# EAGLE design cc2530-LR-standalone-router (EAGLE 9.6.2)
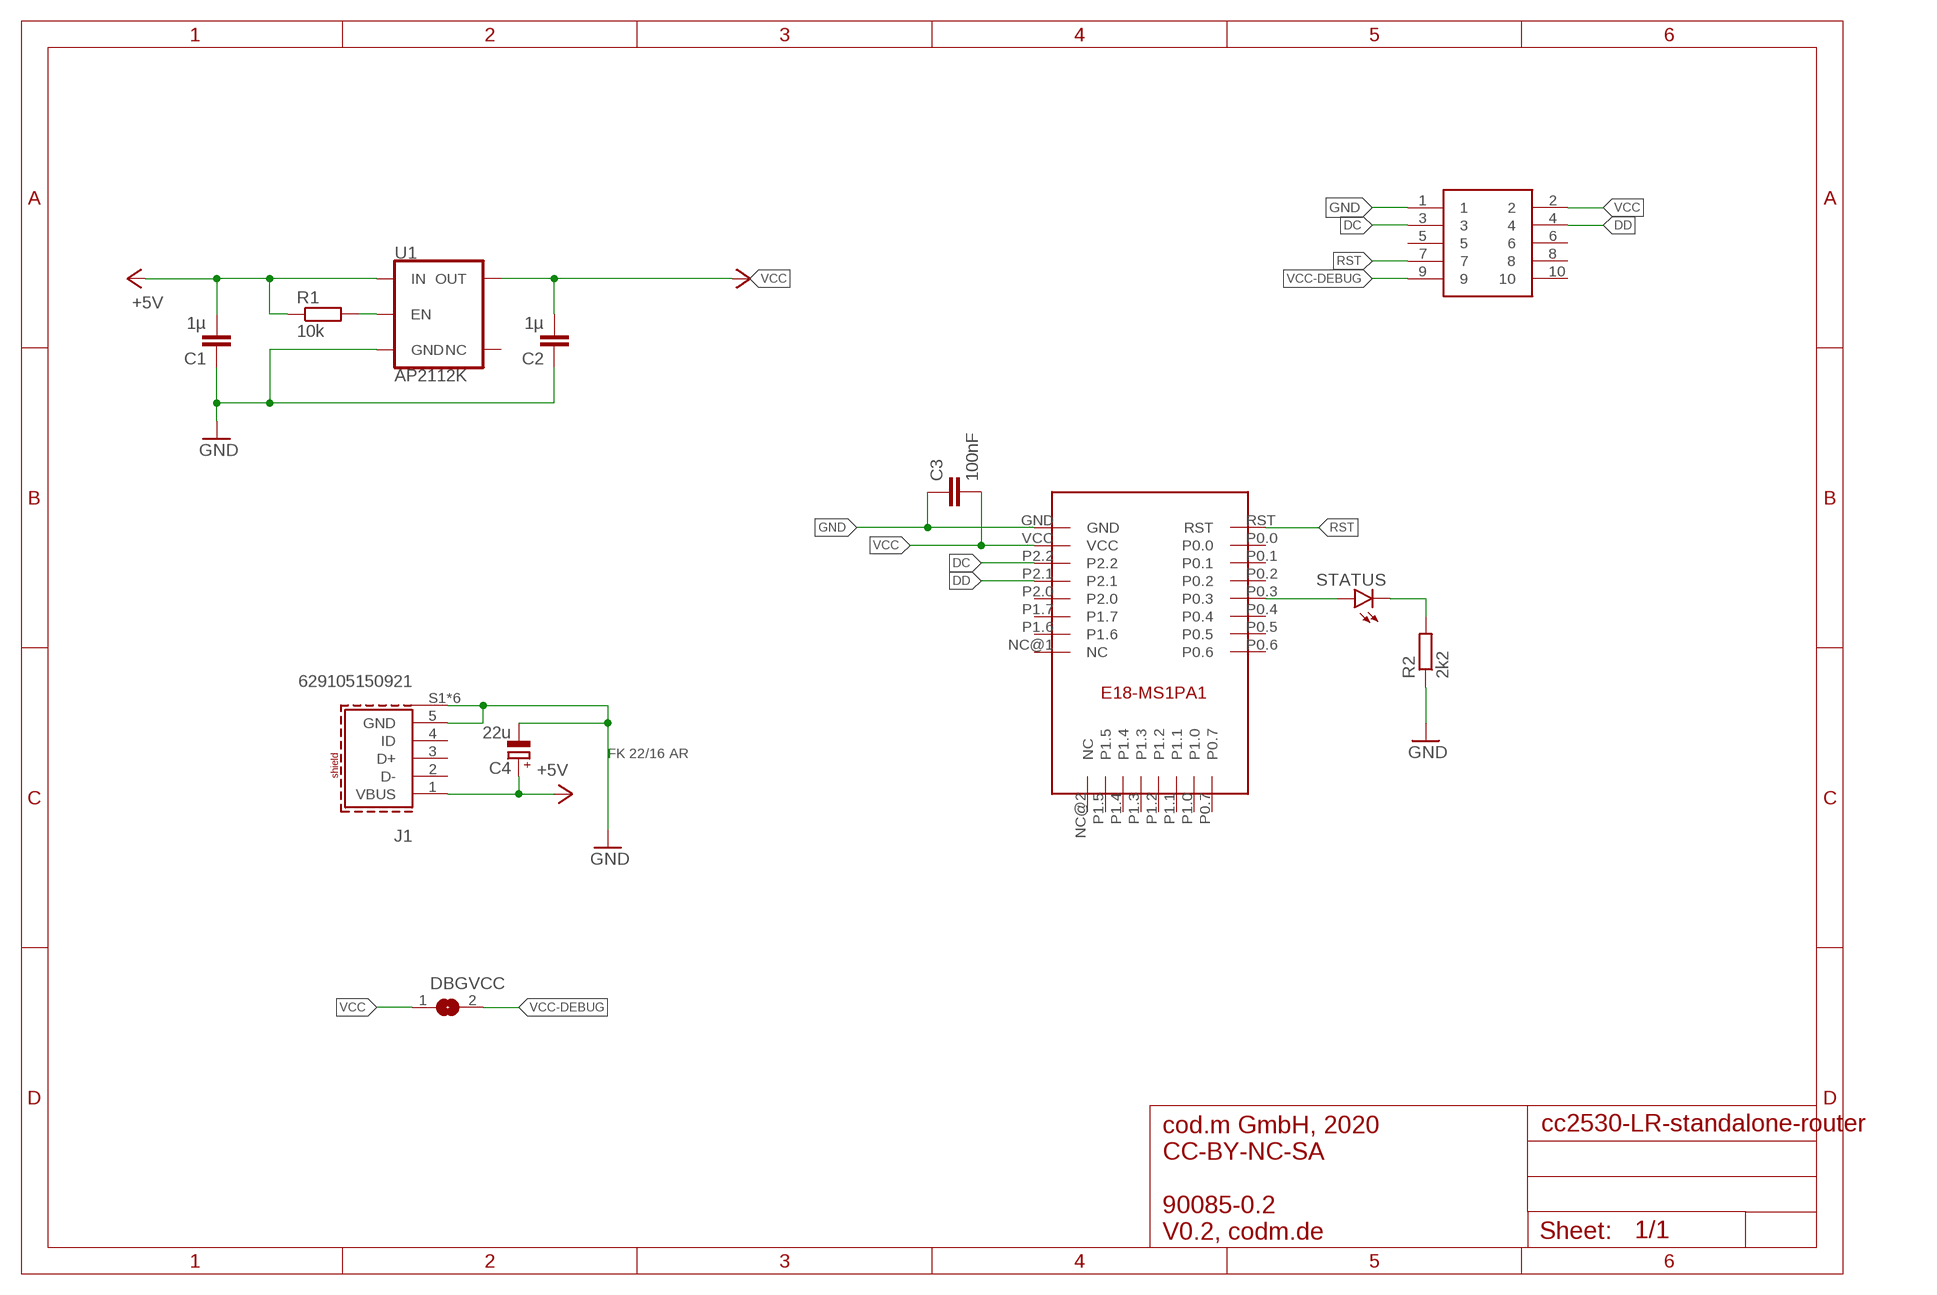
[diagram p0: schematic, sheet 1]

## Parts
C1  1µ  C-EUC0805  [C0805]
C2  1µ  C-EUC0805  [C0805]
C3  100nF  C-EUC0805  [C0805]
C4  22u  CPOL-EUC  [PANASONIC_C]
DBGVCC  SJ  [SJ]
DEBUG  20021121-00010C4LF  [2002112100010C4LF]
J1  629105150921  [629105150921]
R1  10k  R-EU_R0805  [R0805]
R2  2k2  R-EU_R0805  [R0805]
STATUS  LEDCHIPLED_0805  [CHIPLED_0805]
U1  AP2112K  V_REG_AP2112K-3.3V  [SOT23-5]
U$5  E18-MS1PA1IPX  [E18-MS1PA1-IPX]

## Nets
+5V: C1.2 C4.+ J1.1(VBUS) R1.1 U1.1(IN)
DC: DEBUG.3 U$5.P2.2
DD: DEBUG.4 U$5.P2.1
GND: C1.1 C2.1 C3.1 C4.- DEBUG.1 J1.5(GND) J1.S1(SHIELD) J1.S2(SHIELD) J1.S3(SHIELD) J1.S4(SHIELD) J1.S5(SHIELD) J1.S6(SHIELD) R2.1 U1.2(GND) U$5.GND
N$1: R1.2 U1.3(EN)
N$2: R2.2 STATUS.C
N$3: STATUS.A U$5.P0.3
RST: DEBUG.7 U$5.RST
VCC: C2.2 C3.2 DBGVCC.1 DEBUG.2 U1.5(OUT) U$5.VCC ; supply symbol labelled +3V3
VCC-DEBUG: DBGVCC.2 DEBUG.9
Unconnected: DEBUG.5 DEBUG.6 DEBUG.8 DEBUG.10 J1.2(D-) J1.3(D+) J1.4(ID) U1.4(NC) U$5.NC@1(NC) U$5.NC@2(NC) U$5.P0.0 U$5.P0.1 U$5.P0.2 U$5.P0.4 U$5.P0.5 U$5.P0.6 U$5.P0.7 U$5.P1.0 U$5.P1.1 U$5.P1.2 U$5.P1.3 U$5.P1.4 U$5.P1.5 U$5.P1.6 U$5.P1.7 U$5.P2.0

## Notes on the sheet
- FK 22/16 AR
- cod.m GmbH, 2020
  CC-BY-NC-SA
  
  90085-0.2
  V0.2, codm.de

## Library data of the parts
C1-C3 = rcl:C-EU: CAPACITOR, European symbol; SPICEPREFIX: C
C4 = rcl:CPOL-EU: POLARIZED CAPACITOR, European symbol; SPICEPREFIX: C
DBGVCC = jumper:SJ: SMD solder JUMPER
DEBUG = 20021121-00010C4LF:20021121-00010C4LF: Headers & Wire Housings 1.27x1.27mm BTB, Hdr Unshrd, SMT, 10 Pos Source: Datasheet; DESCRIPTION: Headers & Wire Housings 1.27x1.27mm BTB, Hdr Unshrd, SMT, 10 Pos; HEIGHT: 4.55mm; MANUFACTURER_NAME: Amphenol; MANUFACTURER_PART_NUMBER: 20021121-00010C4LF; MOUSER_PART_NUMBER: 649-202112100010C4LF; MOUSER_PRICE-STOCK: https://www.mouser.com/Search/Refine.aspx?Keyword=649-202112100010C4LF
J1 = WR-USB_Rev20b:629105150921: WR-COM Micro USB 2.0 Type AB Horizontal Kind Properties Durability:10 000 Mating cycles Connector Type:Micro USB Gender:Receptacle Type:Horizontal General Information Operating Temperature:-40up to +85 °C Electrical Properties Working Voltage:30V (AC) Withstanding Voltage:100V (AC) Contact Resistance:30 mΩ Material Properties Insulator Material:LCP Insulator Flammability Rating:UL94 V-0 Color:Black Contact Material:Copper Alloy Contact Plating: Gold Contact Type:Stamped Shielding Material:Stainless Steel Shielding Plating:Matte Tin <https://www.we-online.com/catalog/media/o33046v209%20Family_WR-COM_Micro_USB_629105150921.jpg> Details see: https://www.we-online.com/catalog/en/COM_MICRO_2_0_TYPE_AB_HORIZONTAL/ Updated by Ella Wu 2020-05-27 2020 (C) Würth Elektronik; APPLICATION: Micro USB 2.0; DATASHEET-URL: https://www.we-online.com/catalog/datasheet/629105150921.pdf; GERDER: Receptacle; INTERFACE-TYPE: Type AB; IR1: 1.8A; MOUNT: SMT; PACKAGING: Tape and Reel; PART-NUMBER: 629105150921; PINS: 5; TYPE: Horizontal; WORKING-VOLTAGE: 30V(AC)
R1 R2 = rcl:R-EU_: RESISTOR, European symbol; SPICEPREFIX: R
STATUS = led:LED: LED OSRAM: - CHIPLED LG R971, LG N971, LY N971, LG Q971, LY Q971, LO R971, LY R971 LH N974, LH R974 LS Q976, LO Q976, LY Q976 LO Q996 - Hyper CHIPLED LW Q18S LB Q993, LB Q99A, LB R99A - SideLED LS A670, LO A670, LY A670, LG A670, LP A670 LB A673, LV A673, LT A673, LW A673 LH A674 LY A675 LS A676, LA A676, LO A676, LY A676, LW A676 LS A679, LY A679, LG A679 - Hyper Micro SIDELED® LS Y876, LA Y876, LO Y876, LY Y876 LT Y87S - SmartLED LW L88C, LW L88S LB L89C, LB L89S, LG L890 LS L89K, LO L89K, LY L89K LS L896, LA L896, LO L896, LY L896 - TOPLED LS T670, LO T670, LY T670, LG T670, LP T670 LSG T670, LSP T670, LSY T670, LOP T670, LYG T670 LG T671, LOG T671, LSG T671 LB T673, LV T673, LT T673, LW T673 LH T674 LS T676, LA T676, LO T676, LY T676, LB T676, LH T676, LSB T676, LW T676 LB T67C, LV T67C, LT T67C, LS T67K, LO T67K, LY T67K, LW E67C LS E67B, LA E67B, LO E67B, LY E67B, LB E67C, LV E67C, LT E67C LW T67C LS T679, LY T679, LG T679 LS T770, LO T770, LY T770, LG T770, LP T770 LB T773, LV T773, LT T773, LW T773 LH T774 LS E675, LA E675, LY E675, LS T675 LS T776, LA T776, LO T776, LY T776, LB T776 LHGB T686 LT T68C, LB T68C - Hyper Mini TOPLED® LB M676 - Mini TOPLED Santana® LG M470 LS M47K, LO M47K, LY M47K Source: http://www.osram.convergy.de LUXEON: - LUMILED® LXK2-PW12-R00, LXK2-PW12-S00, LXK2-PW14-U00, LXK2-PW14-V00 LXK2-PM12-R00, LXK2-PM12-S00, LXK2-PM14-U00 LXK2-PE12-Q00, LXK2-PE12-R00, LXK2-PE12-S00, LXK2-PE14-T00, LXK2-PE14-U00 LXK2-PB12-K00, LXK2-PB12-L00, LXK2-PB12-M00, LXK2-PB14-N00, LXK2-PB14-P00, LXK2-PB14-Q00 LXK2-PR12-L00, LXK2-PR12-M00, LXK2-PR14-Q00, LXK2-PR14-R00 LXK2-PD12-Q00, LXK2-PD12-R00, LXK2-PD12-S00 LXK2-PH12-R00, LXK2-PH12-S00 LXK2-PL12-P00, LXK2-PL12-Q00, LXK2-PL12-R00 Source: www.luxeon.com KINGBRIGHT: KA-3528ASYC Source: www.kingbright.com
U1 = SparkFun-IC-Power:V_REG_AP2112: AP2112 - 600mA CMOS LDO Regulator w/ Enable The AP2112 is CMOS process low dropout linear regulator with enable function, the regulator delivers a guaranteed 600mA (min.) continuous load current. Features Output Voltage Accuracy: ±1.5% Output Current: 600mA (Min.) Foldback Short Current Protection: 50mA Enable Function to Turn ON/OFF VOUT Low Dropout Voltage (3.3V): 250mV (Typ.) @IOUT=600mA Excellent Load Regulation: 0.2%/A (Typ.) Excellent Line Regulation: 0.02%/V (Typ.) Low Quiescent Current: 55μA (Typ.) Low Standby Current: 0.01μA (Typ.) Low Output Noise: 50μVRMS PSRR: 100Hz -65dB, 1kHz -65dB OTSD Protection Stable with 1.0μF Flexible Cap: Ceramic, Tantalum and Aluminum Electrolytic Operation Temperature Range: -40°C to 85°C ESD: MM 400V, HBM 4000V; PROD_ID: VREG-12457; VALUE: 3.3V
U$5 = codm:E18-MS1PA1

## Board
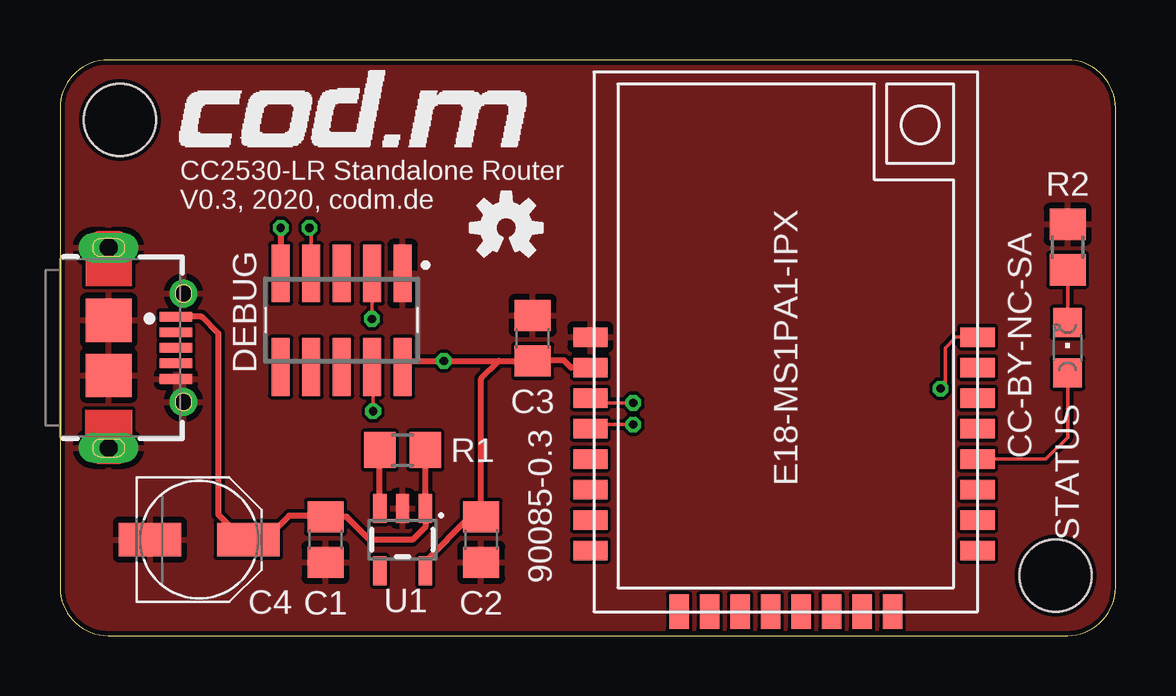
[diagram p1: board, top side]
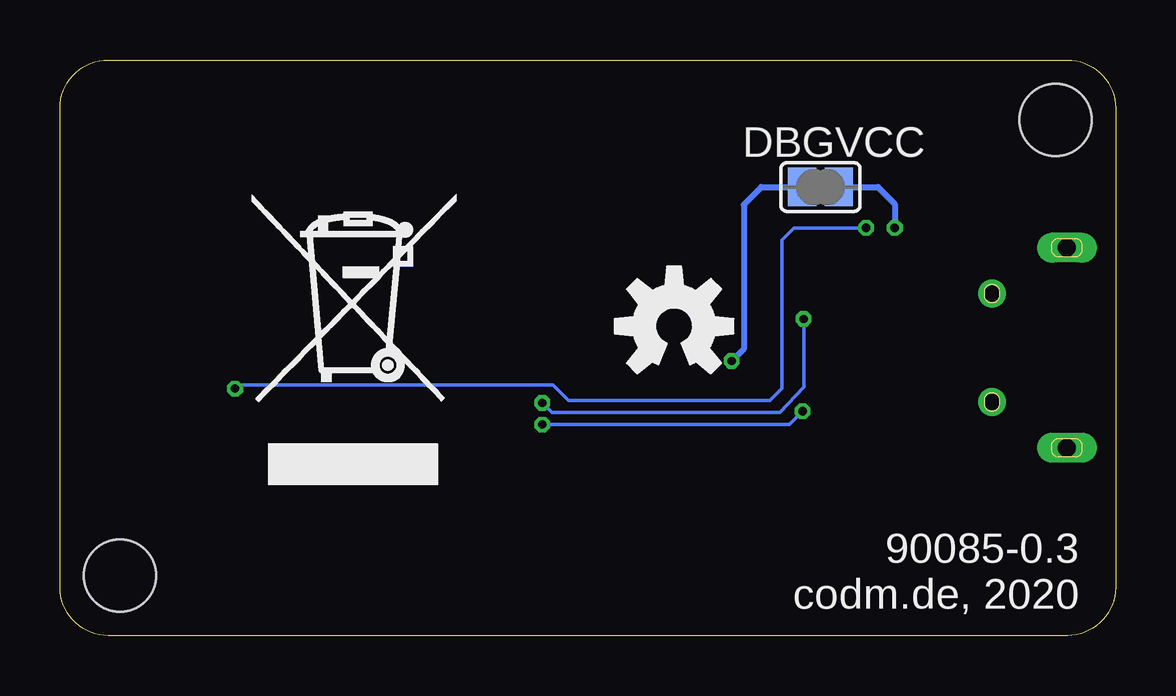
[diagram p2: board, bottom side, seen from below]

Size 44 x 24 mm. Coordinates in mm from the lower left corner, seen from the top.
Outline: 0,2 arc90 2,0 42,0 arc90 44,2 44,22 arc90 42,24 2,24 arc90 0,22 0,2
Copper layers (1*16): Top 0.035mm / dielectric 1.5mm / Bottom 0.035mm
Design rules "aisler_2_layer": minimum track width 0.1mm, minimum drill 0.2mm, track to track 0.15mm, track to pad 0.1mm, pad to pad 0.1mm, via to via 0.1mm, smd to smd 0.1mm, copper to edge 0.2mm, drill to drill 0.21mm, minimum pad ring 0.25mm, minimum via ring 0.15mm, stop-mask expansion 0mil, vias tented up to drill 0mil, thermal gap 10mil
Holes 3 mm at 41.5,2.5 2.5,21.5

### Footprints (pad centres in the part's own frame; a part is rotated, then mirrored left to right if it is on the bottom)
C0805 = smd 1.3 x 1.5: 1 -0.95,0; 2 0.95,0
PANASONIC_C = smd 2.6 x 1.4: + 2.05,0; - -2.05,0
SJ = smd 1.168 x 1.6: 1 -0.762,0; 2 0.762,0
2002112100010C4LF = smd 0.76 x 2.4: 1 -2.54,-1.95; 2 -2.54,1.95; 3 -1.27,-1.95; 4 -1.27,1.95; 5 0,-1.95; 6 0,1.95; 7 1.27,-1.95; 8 1.27,1.95; 9 2.54,-1.95; 10 2.54,1.95
629105150921 = smd 0.4 x 1.35: 1 -1.3,2.335; 2 -0.65,2.335; 3 0,2.335; 4 0.65,2.335; 5 1.3,2.335 | drill 0.65 pad 1.05: S1 -2.26,2.65; S2 2.26,2.65 | drill 0.75 pad 0.95 long: S3 -4.175,-0.47; S6 4.175,-0.47 | smd 1.8 x 1.9: S4 -1.15,-0.47; S5 1.15,-0.47
R0805 = smd 1.3 x 1.5: 1 -0.95,0; 2 0.95,0
CHIPLED_0805 = smd 1.2 x 1.2: A 0,-1.05; C 0,1.05
SOT23-5 = smd 0.55 x 1.2: 1 -0.95,-1.3; 2 0,-1.3; 3 0.95,-1.3; 4 0.95,1.3; 5 -0.95,1.3
E18-MS1PA1-IPX = smd 0.813 x 1.422: GND 11.44,16.14; NC@1 2.55,16.14; P0.0 10.17,0; P0.1 8.9,0; P0.2 7.63,0; P0.3 6.36,0; P0.4 5.09,0; P0.5 3.82,0; P0.6 2.55,0; P1.6 3.82,16.14; P1.7 5.09,16.14; P2.0 6.36,16.14; P2.1 7.63,16.14; P2.2 8.9,16.14; RST 11.44,0; VCC 10.17,16.14 | smd 1.422 x 0.813: NC@2 0,12.44; P0.7 0,3.55; P1.0 0,4.82; P1.1 0,6.09; P1.2 0,7.36; P1.3 0,8.63; P1.4 0,9.9; P1.5 0,11.17

### Placement (x,y rotation side)
C1  11.07,4 90 top
C2  17.56,4 90 top
C3  19.7,12.4 270 top
C4  5.8,4 0 top
DBGVCC  12.3,18.7 0 bottom
DEBUG  11.74,13.15 180 top
J1  2.5,12 270 top
R1  14.28,7.73 180 top
R2  42,16.2 270 top
STATUS  42,12 0 top
U1  14.28,4 180 top
U$1  [WEEE-LOGO-8MM]  36,6.3 0 bottom
U$2  [CODM-LOGO]  5,20.4 0 top
U$3  [OSHW-LOGO-M]  18.4,12.9 0 bottom
U$4  [OSHW-LOGO-S]  18.6,17 0 top
U$5  38.25,1 90 top

### Tracks (layer width: path | path; a pad name or v marks a point on that pad's centre or on a via)
+5V
  Top 0.152: C4.+ 8.55,4
  Top 0.254: R1.1 U1.1 15.23,4.53 14.7,4 12.9,4 11.95,4.95 C1.2 11.02,5 9.55,5 8.55,4 | J1.1 5.9,13.3 6.6,12.6 6.6,5.05 7.65,4 C4.+
DC  (via drill 0.35)
  Top 0.152: DEBUG.3 v13.01,13.21 v13,13.2 | U$5.P2.2 22.45,9.7 v23.9,9.7
  Bottom 0.152: v13,13.2 13,10.38 14,9.3 23.5,9.3 v23.9,9.7
DD  (via drill 0.35)
  Top 0.152: DEBUG.4 13.05,11.16 v13.05,9.35 | U$5.P2.1 22.37,8.77 22.4,8.8 v23.9,8.8
  Bottom 0.152: v23.9,8.8 13.6,8.8 v13.05,9.35
GND
  pour Top: 0,0 0,24 44,24 44,0
N$1
  Top 0.254: U1.3 R1.2
N$2
  Top 0.152: R2.2 STATUS.C
N$3
  Top 0.152: U$5.P0.3 41.1,7.36 42,8.26 STATUS.A
RST  (via drill 0.35)
  Top 0.152: v36.7,10.3 36.9,10.5 36.9,12 37.34,12.44 U$5.RST | v10.4,17 10.47,16.93 DEBUG.7
  Bottom 0.152: v36.7,10.3 36.55,10.45 23.45,10.45 22.8,9.8 14.4,9.8 13.9,10.3 13.9,16.5 13.4,17 v10.4,17
VCC  (via drill 0.35)
  Top 0.254: U1.5 15.23,3.1 17.08,4.95 C2.2 17.56,10.71 18.3,11.45 | DEBUG.2 14.53,11.45 v16,11.45 18.3,11.45 | U$5.VCC 21.31,11.17 21.01,11.47 19.72,11.47 C3.2 18.3,11.45
  Bottom 0.254: DBGVCC.1 14.76,18.7 15.5,17.96 15.5,11.95 v16,11.45
VCC-DEBUG  (via drill 0.35)
  Top 0.254: v9.2,17 DEBUG.9
  Bottom 0.254: DBGVCC.2 9.9,18.7 9.2,18 v9.2,17

### Text on the board
tNames: CC2530-LR Standalone Router / V0.3, 2020, codm.de | CC-BY-NC-SA | 90085-0.3
bNames: 90085-0.3 / codm.de, 2020